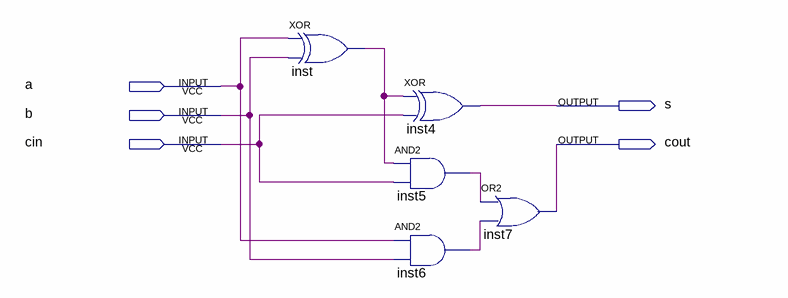
[diagram p0: schematic sheet]
// Quartus schematic fa.bdf as structural Verilog: 5 symbols, 5 pins
module fa (
  input  a,
  input  b,
  input  cin,
  output s,
  output cout
);

  wire inst5_out, inst6_out, inst_out;

  xor inst (inst_out, a, b);
  xor inst4 (s, inst_out, cin);
  and inst5 (inst5_out, inst_out, cin);
  and inst6 (inst6_out, a, b);
  or inst7 (cout, inst5_out, inst6_out);
endmodule
